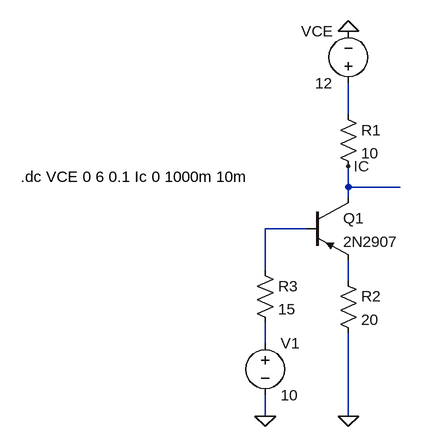
[diagram p0: schematic 1.asc]
1.asc, the LTspice schematic file:
Version 4
SHEET 1 936 680
WIRE 256 32 256 -16
WIRE 256 144 256 112
WIRE 336 144 256 144
WIRE 256 160 256 144
WIRE 192 208 128 208
WIRE 128 272 128 208
WIRE 256 288 256 256
WIRE 128 384 128 352
WIRE 128 496 128 464
WIRE 256 496 256 368
FLAG 128 496 0
FLAG 256 496 0
FLAG 256 -96 0
FLAG 256 112 IC
SYMBOL pnp 192 160 R0
SYMATTR InstName Q1
SYMATTR Value 2N2907
SYMBOL res 240 16 R0
SYMATTR InstName R1
SYMATTR Value 10
SYMBOL res 240 272 R0
SYMATTR InstName R2
SYMATTR Value 20
SYMBOL res 112 256 R0
SYMATTR InstName R3
SYMATTR Value 15
SYMBOL voltage 128 368 R0
WINDOW 123 0 0 Left 0
WINDOW 39 0 0 Left 0
SYMATTR InstName V1
SYMATTR Value 10
SYMBOL voltage 256 0 R180
WINDOW 0 24 96 Left 2
WINDOW 3 24 16 Left 2
WINDOW 123 0 0 Left 0
WINDOW 39 0 0 Left 0
SYMATTR InstName VCE
SYMATTR Value 12
TEXT -248 128 Left 2 !.dc VCE 0 6 0.1 Ic 0 1000m 10m

The netlist it stands for:
* 1.asc
Q1 IC N002 N003 0 2N2907
R1 N001 IC 10
R2 N003 0 20
R3 N002 N004 15
V1 N004 0 10
VCE N001 0 12
.model NPN NPN
.model PNP PNP
.lib standard.bjt
.dc VCE 0 6 0.1 Ic 0 1000m 10m
.backanno
.end